# Altium schematic sheet dac.SchDoc
size A
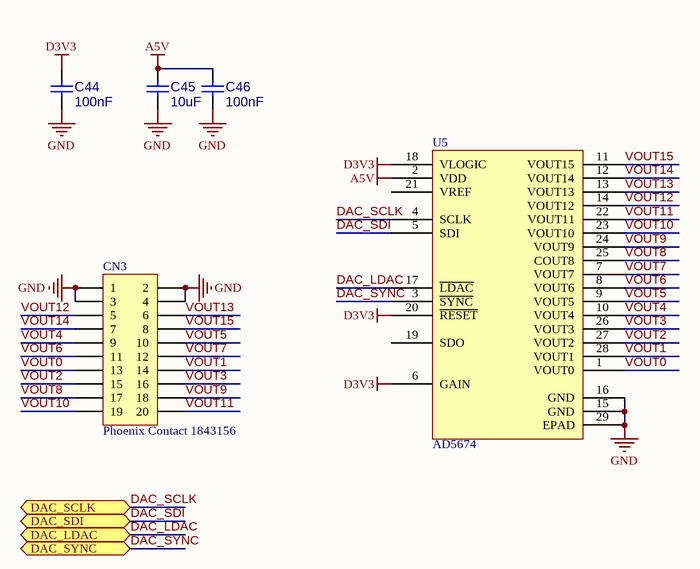
[diagram p0: dac.SchDoc]

## Parts
C44  100nF  [C0603]
C45  10uF  [C1206N]
C46  100nF  [C0603]
CN3  Phoenix Contact 1843156  [PHOENIX1843156]
U5  AD5674  [PNI-MAGI2C]

## Ports
DAC_LDAC, DAC_SCLK, DAC_SDI, DAC_SYNC

## Nets
A5V: C45.1 C46.1 U5.2(VDD)
D3V3: C44.1 U5.6(GAIN) U5.18(VLOGIC) U5.20(~{RESET})
GND: C44.2 C45.2 C46.2 CN3.1 CN3.2 CN3.3 CN3.4 U5.15(GND) U5.16(GND) U5.29(EPAD)
DAC_LDAC: U5.17(~{LDAC}) ; port DAC_LDAC
DAC_SCLK: U5.4(SCLK) ; port DAC_SCLK
DAC_SDI: U5.5(SDI) ; port DAC_SDI
DAC_SYNC: U5.3(~{SYNC}) ; port DAC_SYNC
VOUT0: CN3.13 U5.1(VOUT0)
VOUT1: CN3.14 U5.28(VOUT1)
VOUT2: CN3.15 U5.27(VOUT2)
VOUT3: CN3.16 U5.26(VOUT3)
VOUT4: CN3.9 U5.10(VOUT4)
VOUT5: CN3.10 U5.9(VOUT5)
VOUT6: CN3.11 U5.8(VOUT6)
VOUT7: CN3.12 U5.7(VOUT7)
VOUT8: CN3.17 U5.25(COUT8)
VOUT9: CN3.18 U5.24(VOUT9)
VOUT10: CN3.19 U5.23(VOUT10)
VOUT11: CN3.20 U5.22(VOUT11)
VOUT12: CN3.5 U5.14(VOUT12)
VOUT13: CN3.6 U5.13(VOUT13)
VOUT14: CN3.7 U5.12(VOUT14)
VOUT15: CN3.8 U5.11(VOUT15)

Not connected (* = marked no-connect by the designer): U5 19(SDO) 21(VREF)

## Library data of the parts
C44 C46 = Cap: GRM155R71C104KA88J; Published: 8-Jun-2000; LatestRevisionDate: 17-Jul-2002; LatestRevisionNote: Re-released for DXP Platform.; PackageReference: RAD-0.3; Publisher: Altium Limited; PackageDescription: Radial Cap, Thru-Hole; 2 Leads; 0.3 in Pin Spacing
C45 = Cap: Capacitor; Published: 8-Jun-2000; LatestRevisionDate: 17-Jul-2002; LatestRevisionNote: Re-released for DXP Platform.; PackageReference: RAD-0.3; Publisher: Altium Limited; PackageDescription: Radial Cap, Thru-Hole; 2 Leads; 0.3 in Pin Spacing
CN3 = Header 10X2: Header, 10-Pin, Dual row; LatestRevisionDate: 17-Jul-2002; LatestRevisionNote: Re-released for DXP Platform.; Publisher: Altium Limited